# Altium schematic sheet CH340G_2025-02-05.schdoc
size 52 x 45 mm
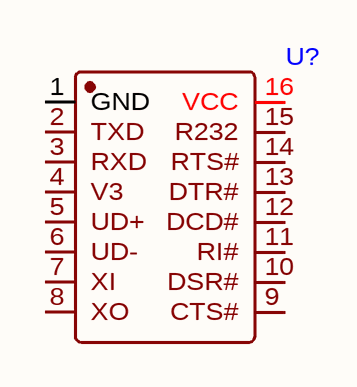
[diagram p0: CH340G_2025-02-05.schdoc]

## Parts
U?  (no value)  [SOIC-16_L9.9-W3.9-P1.27-LS6.0-BL]

## Nets

Not connected (* = marked no-connect by the designer): U? 1(GND) 2(TXD) 3(RXD) 4(V3) 5(UD+) 6(UD-) 7(XI) 8(XO) 9(CTS#) 10(DSR#) 11(RI#) 12(DCD#) 13(DTR#) 14(RTS#) 15(R232) 16(VCC)

## Library data of the parts
U? = CH340G